# Altium schematic sheet Power.SchDoc
size A4
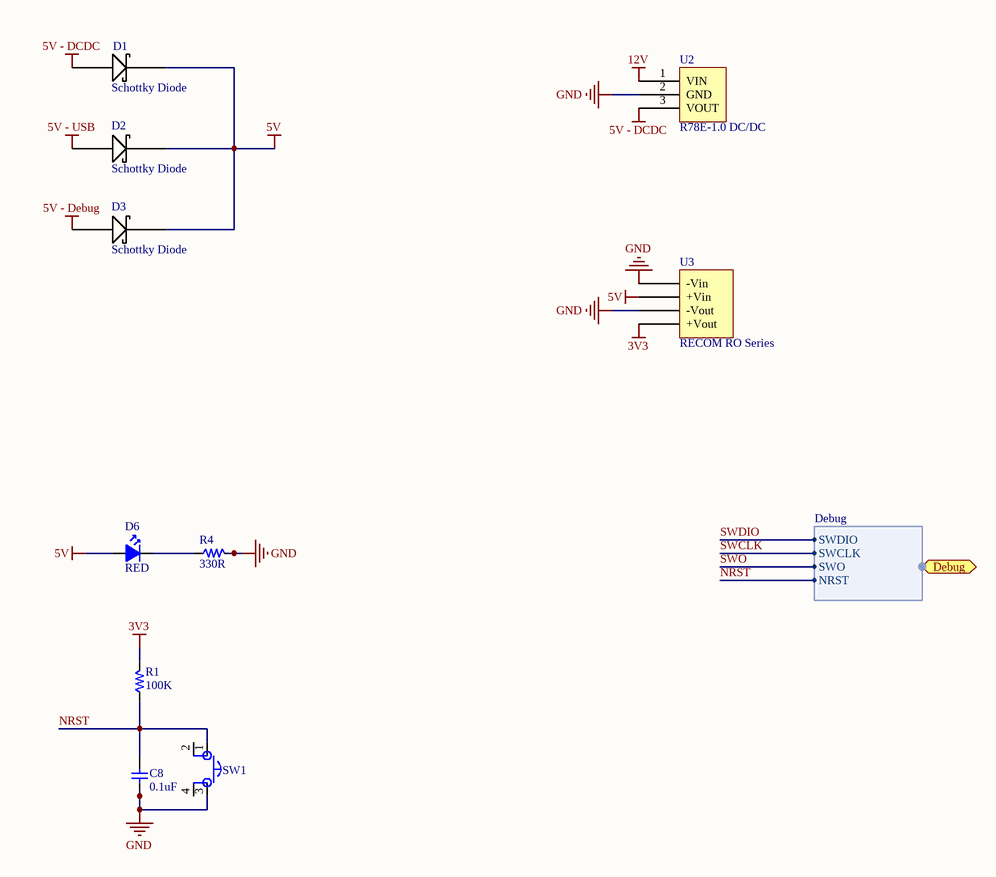
[diagram p0: Power.SchDoc]

## Parts
C8  value 0.1uF  [PCB_GENERIC_SMD_0603]  (hidden comment: C060-000U1-00)
D1  Schottky Diode  [ON Semi Schottky Diode - MBRM110LT1G]
D2  Schottky Diode  [ON Semi Schottky Diode - MBRM110LT1G]
D3  Schottky Diode  [ON Semi Schottky Diode - MBRM110LT1G]
D6  Color: RED  [SMD_0603_LED]  (hidden comment: D060-000R2-00)
R1  value 100K  [PCB_GENERIC_SMD_0603]  (hidden comment: R060-00104-05)
R4  value 330R  [PCB_GENERIC_SMD_0603]  (hidden comment: R060-00331-05)
SW1  Tactile Switch  [C&K 4 pin Tactile Switch]  (value not drawn)
U2  R78E-1.0 DC/DC  [R78-1.0]
U3  RECOM RO Series  [RECOM RO Series 1W DCDC]

## Ports
Debug (harness Debug)

## Harnesses
Debug: SWDIO, SWCLK, SWO, NRST

## Nets
3V3: R1.2 U3.4(+Vout)
5V: D1.1 D2.1 D3.1 D6.2(A) U3.2(+Vin)
5V - DCDC: D1.2 U2.3(VOUT)
5V - Debug: D3.2
5V - USB: D2.2
12V: U2.1(VIN)
GND: C8.1 R4.2 SW1.3 U2.2(GND) U3.1(-Vin) U3.3(-Vout)
NRST: C8.2 R1.1 SW1.1 ; port Debug.NRST
SWCLK: port Debug.SWCLK
SWDIO: port Debug.SWDIO
SWO: port Debug.SWO
NetD6_1: D6.1(K) R4.1

Not connected (* = marked no-connect by the designer): SW1 2 4

## Library data of the parts
C8 = C060-000U1-00: CAP CER 0603 0.1uF 16V X5R 20%; Tolerance: 20%; Voltage: 16V; Package: 0603
D1-D3 = ON Semi Schottky Diode - MBRM110LT1G
D6 = D060-000R2-00: LED 0603 RED 2Vf 20mA; Supplier 1: Digi-Key; Supplier Part Number 1: 732-4978-1-ND
R1 = R060-00104-05: RES 0603 100K 5% 63mW; Tolerance: 5%; Power: 63mW; Package: 0603
R4 = R060-00331-05: RES 0603 330ohm 5% 63mW; Tolerance: 5%; Power: 63mW; Package: 0603
SW1 = C&K Tactile Switch: Supplier 1: Digi-Key; Supplier Part Number 1: CKN9085CT-ND
U2 = R78E-1.0
U3 = RECOM RO Series DCDC Converter